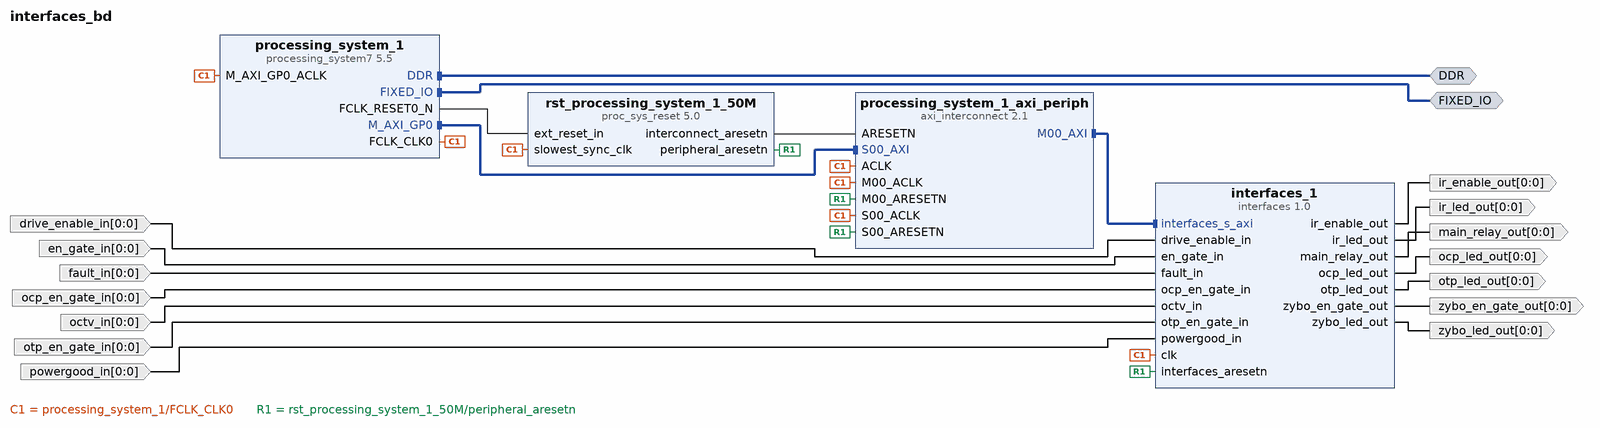
[diagram p0: block diagram of the top level]
# Vivado block design interfaces_bd, Vivado 2015.4
create_bd_design interfaces_bd

create_bd_intf_port -mode Master -vlnv xilinx.com:interface:ddrx_rtl:1.0 DDR
create_bd_intf_port -mode Master -vlnv xilinx.com:display_processing_system7:fixedio_rtl:1.0 FIXED_IO
create_bd_port -dir I -from 0 -to 0 -type data drive_enable_in
create_bd_port -dir I -from 0 -to 0 -type data en_gate_in
create_bd_port -dir I -from 0 -to 0 -type data fault_in
create_bd_port -dir O -from 0 -to 0 -type data ir_enable_out
create_bd_port -dir O -from 0 -to 0 -type data ir_led_out
create_bd_port -dir O -from 0 -to 0 -type data main_relay_out
create_bd_port -dir I -from 0 -to 0 -type data ocp_en_gate_in
create_bd_port -dir O -from 0 -to 0 -type data ocp_led_out
create_bd_port -dir I -from 0 -to 0 -type data octv_in
create_bd_port -dir I -from 0 -to 0 -type data otp_en_gate_in
create_bd_port -dir O -from 0 -to 0 -type data otp_led_out
create_bd_port -dir I -from 0 -to 0 -type data powergood_in
create_bd_port -dir O -from 0 -to 0 -type data zybo_en_gate_out
create_bd_port -dir O -from 0 -to 0 -type data zybo_led_out

create_bd_cell -type ip -vlnv User_Company:SysGen:interfaces:1.0 interfaces_1
create_bd_cell -type ip -vlnv xilinx.com:ip:processing_system7:5.5 processing_system_1
# 2 more settings of processing_system_1 are not shown: defaults, MIO pin electricals, DDR timing, and values the tool derives
create_bd_cell -type ip -vlnv xilinx.com:ip:axi_interconnect:2.1 processing_system_1_axi_periph
set_property -dict {CONFIG.NUM_MI 1} [get_bd_cells processing_system_1_axi_periph]
create_bd_cell -type ip -vlnv xilinx.com:ip:proc_sys_reset:5.0 rst_processing_system_1_50M

# ---- connections ----

connect_bd_intf_net [get_bd_intf_pins processing_system_1/M_AXI_GP0] [get_bd_intf_pins processing_system_1_axi_periph/S00_AXI]
connect_bd_intf_net [get_bd_intf_pins processing_system_1_axi_periph/M00_AXI] [get_bd_intf_pins interfaces_1/interfaces_s_axi]
connect_bd_intf_net [get_bd_intf_ports DDR] [get_bd_intf_pins processing_system_1/DDR]
connect_bd_intf_net [get_bd_intf_ports FIXED_IO] [get_bd_intf_pins processing_system_1/FIXED_IO]
connect_bd_net [get_bd_pins processing_system_1/FCLK_CLK0] \
  [get_bd_pins processing_system_1/M_AXI_GP0_ACLK] [get_bd_pins processing_system_1_axi_periph/S00_ACLK] \
  [get_bd_pins rst_processing_system_1_50M/slowest_sync_clk] [get_bd_pins processing_system_1_axi_periph/ACLK] \
  [get_bd_pins interfaces_1/clk] [get_bd_pins processing_system_1_axi_periph/M00_ACLK]
connect_bd_net [get_bd_pins processing_system_1/FCLK_RESET0_N] [get_bd_pins rst_processing_system_1_50M/ext_reset_in]
connect_bd_net [get_bd_pins rst_processing_system_1_50M/peripheral_aresetn] \
  [get_bd_pins processing_system_1_axi_periph/S00_ARESETN] [get_bd_pins interfaces_1/interfaces_aresetn] \
  [get_bd_pins processing_system_1_axi_periph/M00_ARESETN]
connect_bd_net [get_bd_pins rst_processing_system_1_50M/interconnect_aresetn] [get_bd_pins processing_system_1_axi_periph/ARESETN]
connect_bd_net [get_bd_ports drive_enable_in] [get_bd_pins interfaces_1/drive_enable_in]
connect_bd_net [get_bd_ports en_gate_in] [get_bd_pins interfaces_1/en_gate_in]
connect_bd_net [get_bd_ports fault_in] [get_bd_pins interfaces_1/fault_in]
connect_bd_net [get_bd_pins interfaces_1/ir_enable_out] [get_bd_ports ir_enable_out]
connect_bd_net [get_bd_pins interfaces_1/ir_led_out] [get_bd_ports ir_led_out]
connect_bd_net [get_bd_pins interfaces_1/main_relay_out] [get_bd_ports main_relay_out]
connect_bd_net [get_bd_ports ocp_en_gate_in] [get_bd_pins interfaces_1/ocp_en_gate_in]
connect_bd_net [get_bd_pins interfaces_1/ocp_led_out] [get_bd_ports ocp_led_out]
connect_bd_net [get_bd_ports octv_in] [get_bd_pins interfaces_1/octv_in]
connect_bd_net [get_bd_ports otp_en_gate_in] [get_bd_pins interfaces_1/otp_en_gate_in]
connect_bd_net [get_bd_pins interfaces_1/otp_led_out] [get_bd_ports otp_led_out]
connect_bd_net [get_bd_ports powergood_in] [get_bd_pins interfaces_1/powergood_in]
connect_bd_net [get_bd_pins interfaces_1/zybo_en_gate_out] [get_bd_ports zybo_en_gate_out]
connect_bd_net [get_bd_pins interfaces_1/zybo_led_out] [get_bd_ports zybo_led_out]

# ---- address map ----
assign_bd_address -offset 0x43C00000 -range 64K -target_address_space [get_bd_addr_spaces processing_system_1/Data] [get_bd_addr_segs interfaces_1/interfaces_s_axi/reg0]

validate_bd_design
save_bd_design
